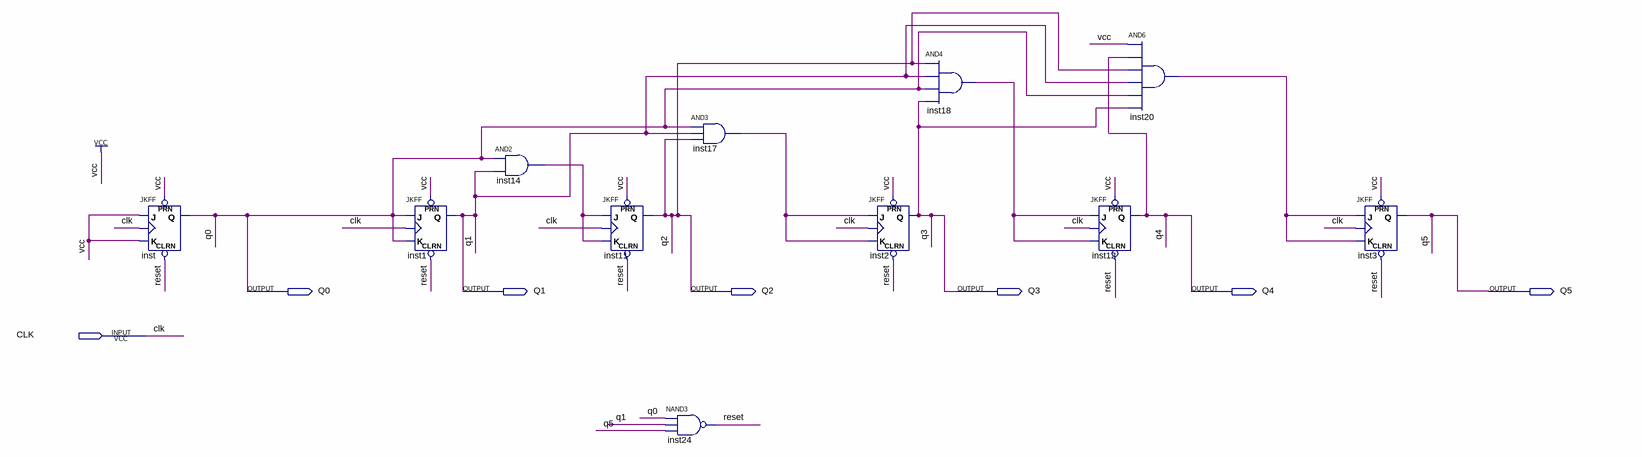
[diagram p0: schematic sheet]
// Quartus schematic Contador.bdf as structural Verilog: 11 symbols, 7 pins
module Contador (
  input  CLK,
  output Q0,
  output Q1,
  output Q2,
  output Q3,
  output Q4,
  output Q5
);

  wire inst14_out, inst17_out, inst18_out, inst20_out, reset;

  JKFF inst (.PRN(1'b1), .CLRN(reset), .K(1'b1), .J(1'b1), .CLK(CLK), .Q(Q0));
  JKFF inst1 (.PRN(1'b1), .CLRN(reset), .K(Q0), .J(Q0), .CLK(CLK), .Q(Q1));
  and inst14 (inst14_out, Q0, Q1);
  JKFF inst11 (.PRN(1'b1), .CLRN(reset), .K(inst14_out), .J(inst14_out), .CLK(CLK), .Q(Q2));
  nand inst24 (reset, Q0, Q1, Q5);
  and inst17 (inst17_out, Q0, Q1, Q2);
  JKFF inst2 (.PRN(1'b1), .CLRN(reset), .K(inst17_out), .J(inst17_out), .CLK(CLK), .Q(Q3));
  and inst18 (inst18_out, Q2, Q1, Q0, Q3);
  and inst20 (inst20_out, 1'b1, Q4, Q2, Q1, Q0, Q3);
  JKFF inst12 (.PRN(1'b1), .CLRN(reset), .K(inst18_out), .J(inst18_out), .CLK(CLK), .Q(Q4));
  JKFF inst3 (.PRN(1'b1), .CLRN(reset), .K(inst20_out), .J(inst20_out), .CLK(CLK), .Q(Q5));
endmodule
